# Altium schematic sheet Prim_CTRL.SchDoc: Sheetname
size A4; Date: 05.10.2017; CheckedBy: UNCHECKED; Author: Team Member; Organization: Baltic Racing; Address1: Zur Schwedenschanze 15; Address2: Haus 18; Address3: 18435 Stralsund; Revision: xx.xx; SheetNumber: 3; SheetTotal: 8; Rules: TODO; ProjectName: Projekt
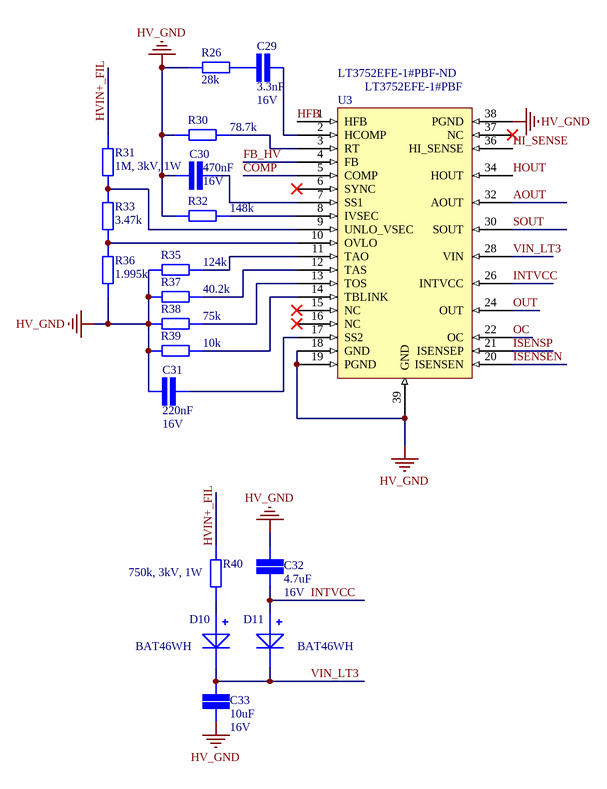
[diagram p0: Prim_CTRL.SchDoc]

## Parts
C29  value 3.3nF  Voltage: 16V  [CAP 0603/1608]  (hidden comment: SMD Capacitor)
C30  value 470nF  Voltage: 16V  [CAP 0603/1608]  (hidden comment: SMD Capacitor)
C31  value 220nF  Voltage: 16V  [CAP 0603/1608]  (hidden comment: SMD Capacitor)
C32  value 4.7uF  Voltage: 16V  [CAP 1206/3216]  (hidden comment: SMD Capacitor)
C33  value 10uF  Voltage: 16V  [CAP 1206/3216]  (hidden comment: SMD Capacitor)
D10  BAT46WH  [DIOM2715X18N]
D11  BAT46WH  [DIOM2715X18N]
R26  value 28k  [STACKPOLE CSR0603]  (hidden comment: SMD Resistor)
R30  value 78.7k  [STACKPOLE CSR0603]  (hidden comment: SMD Resistor)
R31  value 1M, 3kV, 1W  [STACKPOLE CSRN2512]  (hidden comment: CHV2512-FX-1004ELF)
R32  value 148k  [STACKPOLE CSR0603]  (hidden comment: SMD Resistor)
R33  value 3.47k  [STACKPOLE CSR0603]  (hidden comment: SMD Resistor)
R35  value 124k  [STACKPOLE CSR0603]  (hidden comment: SMD Resistor)
R36  value 1.995k  [STACKPOLE CSR0603]  (hidden comment: SMD Resistor)
R37  value 40.2k  [STACKPOLE CSR0603]  (hidden comment: SMD Resistor)
R38  value 75k  [STACKPOLE CSR0603]  (hidden comment: SMD Resistor)
R39  value 10k  [STACKPOLE CSR0603]  (hidden comment: SMD Resistor)
R40  value 750k, 3kV, 1W  [STACKPOLE CSRN2512]  (hidden comment: RCV2512750KFKEGAT)
U3  LT3752EFE-1#PBF  Supplier Part Number 1: LT3752EFE-1#PBF-ND  [TSSOP127P600-8N]

## Nets
HV_GND: C30.2 C31.2 C32.1 C33.1 R26.1 R30.2 R32.2 R35.2 R36.2 R37.2 R38.2 R39.2 U3.18(GND) U3.19(PGND) U3.38(PGND) U3.39(GND)
AOUT: U3.32(AOUT)
COMP: U3.5(COMP)
FB_HV: U3.4(FB)
HFB: U3.1(HFB)
HI_SENSE: U3.36(HI_SENSE)
HOUT: U3.34(HOUT)
HVIN+_FIL: R31.1 R40.2
INTVCC: C32.2 D11.1 U3.26(INTVCC)
ISENSEN: U3.20(ISENSEN)
ISENSP: U3.21(ISENSEP)
OC: U3.22(OC)
OUT: U3.24(OUT)
SOUT: U3.30(SOUT)
VIN_LT3: C33.2 D10.2 D11.2 U3.28(VIN)
NetC29_1: C29.1 R26.2
NetC29_2: C29.2 U3.2(HCOMP)
NetC30_1: C30.1 U3.7(SS1)
NetC31_1: C31.1 U3.17(SS2)
NetD10_1: D10.1 R40.1
NetR30_1: R30.1 U3.3(RT)
NetR31_2: R31.2 R33.1 U3.9(UNLO_VSEC)
NetR32_1: R32.1 U3.8(IVSEC)
NetR33_2: R33.2 R36.1 U3.10(OVLO)
NetR35_1: R35.1 U3.11(TAO)
NetR37_1: R37.1 U3.12(TAS)
NetR38_1: R38.1 U3.13(TOS)
NetR39_1: R39.1 U3.14(TBLINK)

Not connected (* = marked no-connect by the designer): U3 6(SYNC)* 15(NC)* 16(NC)* 37(NC)*

## Notes on the sheet
- Title:
- Projekt:
- Revision:
- Author:
- Rules:
- Checked by:
- Sheet
- of
- Size:
- A4
- Date:
- Time:

## Library data of the parts
C29-C33 = SMD Capacitor: Capacitor with multiple Footprints
R26 R30-R33 R35-R40 = SMD Resistor: Resistor with multiple footprints
U3 = LT3752EFE-1#PBF: Current Mode PWM Controller 100kHz to 500kHz Automotive 31-Pin TSSOP EP Tube; Manufacturer: Analog Devices / Linear Technology; Min Supply Voltage: 10.5V; Max Supply Voltage: 16V; Number of Outputs: 1; Max Duty Cycle: 95%; Synchronous Rectifier: Yes; Topology: Forward Converter; Supplier 1: Digi-Key; Manufacturer Part Number: LT3752EFE-1#PBF; RoHS: Yes; Category: Voltage Regulators - Switching; Stock 1: 108; Pricing 1: 1=8,12000, 10=7,33800, 25=6,99720, 100=6,07550, 250=5,80244, 500=5,31300 (USD); Case/Package: TSSOP; Number of Pins: 38; Min Operating Temperature: -40°C; Max Operating Temperature: 125°C; Frequency: 500kHz; Packaging: Rail/Tube; Number of Output Phases: 1; Switching Frequency: 500kHz; Clock Sync: Yes; REACH SVHC: No SVHC; RoHS Compliant: Yes; ComponentLink1URL: https://datasheet.ciiva.com/46429/1841069-46429096.pdf?src-supplier=Element14; ComponentLink1Description: https://datasheet.ciiva.com/46429/1841069-46429096.pdf?src-supplier=Element14
D10 D11 = BAT46WH: Supplier 1: Mouser